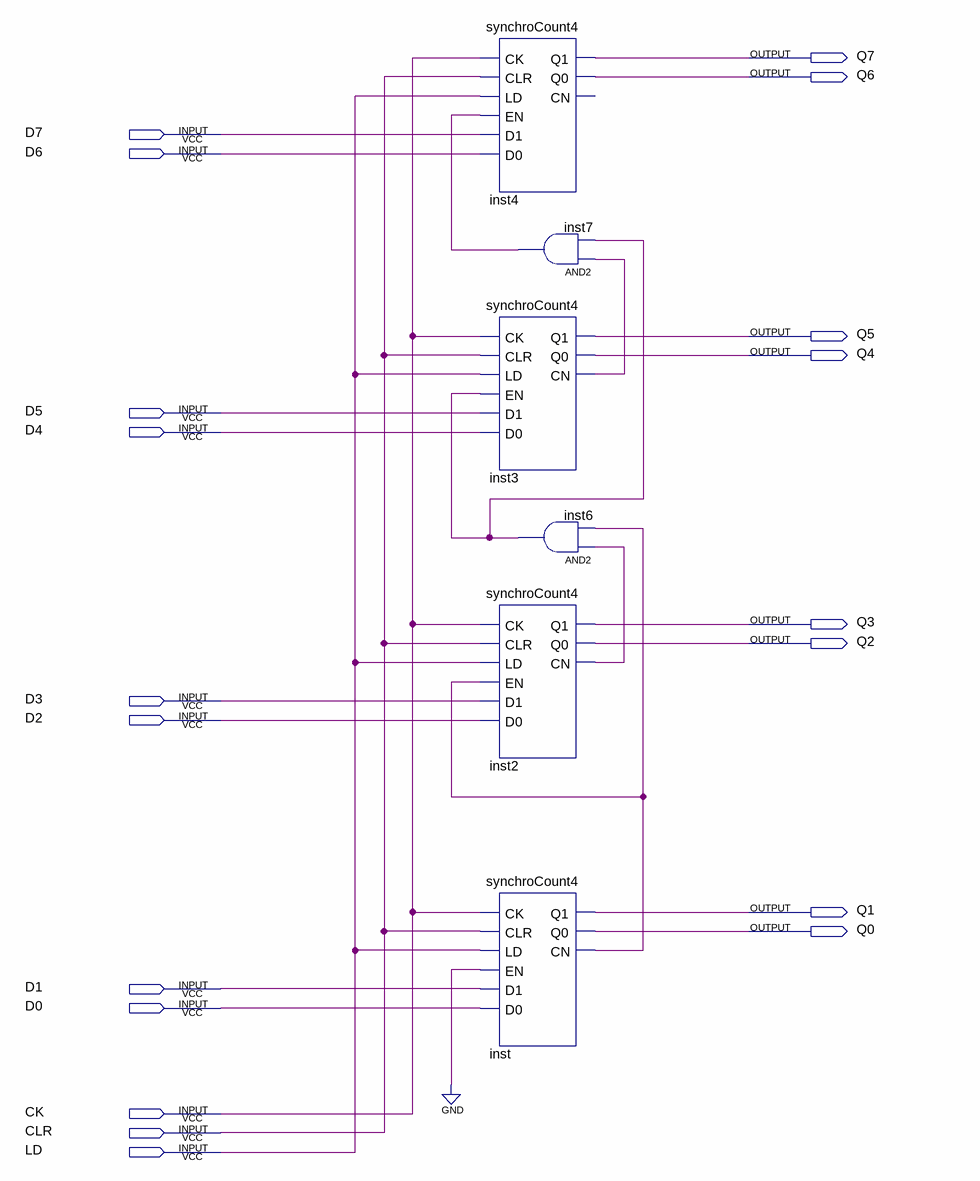
[diagram p0: schematic sheet]
// Quartus schematic synchro-count8.bdf as structural Verilog: 6 symbols, 19 pins
module \synchro-count8  (
  input  D7,
  input  D6,
  input  D5,
  input  D4,
  input  D3,
  input  D2,
  input  D1,
  input  D0,
  input  CK,
  input  CLR,
  input  LD,
  output Q7,
  output Q6,
  output Q5,
  output Q4,
  output Q3,
  output Q2,
  output Q1,
  output Q0
);

  wire inst2_cn, inst3_cn, inst6_out, inst7_out, inst_cn;

  synchroCount4 inst4 (.CK(CK), .CLR(CLR), .LD(LD), .EN(inst7_out), .D1(D7), .D0(D6), .Q1(Q7), .Q0(Q6));  // open: CN
  synchroCount4 inst3 (.CK(CK), .CLR(CLR), .LD(LD), .EN(inst6_out), .D1(D5), .D0(D4), .Q1(Q5), .Q0(Q4), .CN(inst3_cn));
  synchroCount4 inst2 (.CK(CK), .CLR(CLR), .LD(LD), .EN(inst_cn), .D1(D3), .D0(D2), .Q1(Q3), .Q0(Q2), .CN(inst2_cn));
  synchroCount4 inst (.CK(CK), .CLR(CLR), .LD(LD), .EN(1'b0), .D1(D1), .D0(D0), .Q1(Q1), .Q0(Q0), .CN(inst_cn));
  and inst7 (inst7_out, inst3_cn, inst6_out);
  and inst6 (inst6_out, inst2_cn, inst_cn);
endmodule
